# Altium schematic sheet Schematic.SchDoc
size A; SheetNumber: 1; SheetTotal: 1
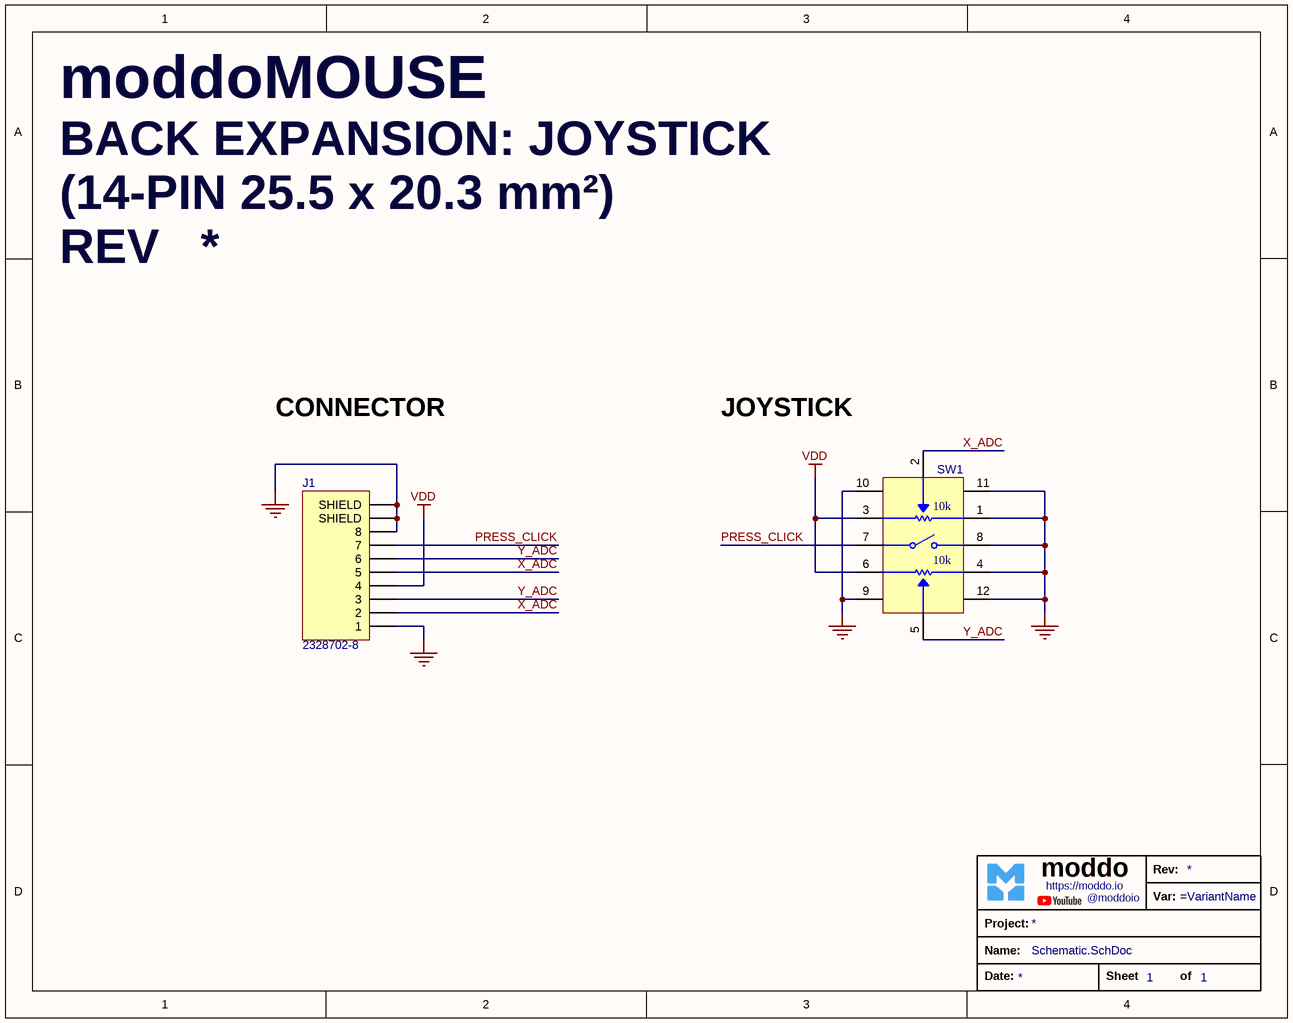
[diagram p0: Schematic.SchDoc]

## Parts
?  TitleBlock_moddo  (value not drawn)  (graphical)
J1  2328702-8  [2328702-8]
SW1  YK16S-L7.2-B10Ka(32-8)-G-A29  [Joystick_14p_25_5mm_20_3mm]  (value not drawn)

## Nets
GND: J1.1 J1.8 J1.S1(SHIELD) J1.S2(SHIELD) SW1.1 SW1.4 SW1.8 SW1.9 SW1.10 SW1.11 SW1.12
VDD: J1.4 SW1.3 SW1.6
PRESS_CLICK: J1.7 SW1.7
X_ADC: J1.2 J1.5 SW1.2
Y_ADC: J1.3 J1.6 SW1.5

## Notes on the sheet
- moddoMOUSE <https://moddo.io/>
- BACK EXPANSION: JOYSTICK <https://moddo.io/>
- (14-PIN 25.5 x 20.3 mm²) <https://moddo.io/>
- REV
- CONNECTOR
- JOYSTICK
- (in symbol TitleBlock_moddo) Rev:; moddo; https://moddo.io; Var:; @moddoio; Project:; Name:; Date:; Sheet; of
- (in symbol YK16S-L7.2-B10Ka(32-8)-G-A29) 10k

## Library data of the parts
J1 = 2328702-8: FFC/FPC Connector, 8 Contact(s), 1 Row(s), Right Angle, Solder Terminal, Natural Insulator; Manufacturer: TE Connectivity; Actuator Material: Thermoplastic; Actuator Color: Black; Plating: Gold; Number of Positions: 8; Voltage Rating: 50V; Connector System: Wire-to-Board; Gender: Receptacle; Sealable: No (Without); Supplier 1: Arrow Electronics; Manufacturer Part Number: 2328702-8; RoHS: Yes; Category: FFC / FPC; Stock 1: 56000; Pricing 1: 28000=0.0961 (USD); Mounting Technology: Surface Mount; Contact Material: Copper Alloy; Contact Plating: Gold; Housing Material: Thermoplastic; Housing Color: Natural; Min Operating Temperature: -40°C; Max Operating Temperature: 85°C; Packaging: Cut Tape; Termination: Solder; Series: -; Number of Contacts: 8; Number of Rows: 1; Operating Supply Voltage: 50V; Orientation: Right Angle; Length: 6mm; Height: 1mm; Flammability Rating: UL94 V-0; ComponentLink1URL: https://www.te.com/commerce/DocumentDelivery/DDEController?Action=srchrtrv&amp;DocNm=2328702&amp;DocType=Customer+Drawing&amp;DocLang=English&src-supplier=Digikey; ComponentLink1Description: https://www.te.com/commerce/DocumentDelivery/DDEController?Action=srchrtrv&amp;DocNm=2328702&amp;DocType=Customer+Drawing&amp;DocLang=English&src-supplier=Digikey; Supplier Part Number 1: 2328702-8
SW1 = YK16S-L7.2-B10Ka(32-8)-G-A29: Through Hole-14P,25.5x20.3mm Navigation Switches, Joystick RoHS; Manufacturer: YTL; Manufacturer Part Number: YK16S-L7.2-B10Ka(32-8)-G-A29